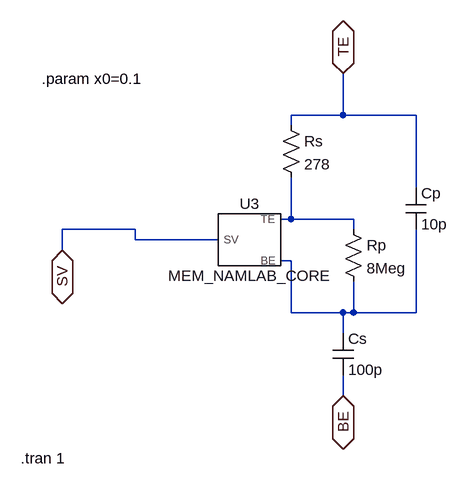
[diagram p0: schematic pseudo_memcapacitor.asc]
pseudo_memcapacitor.asc, the LTspice schematic file:
Version 4
SHEET 1 880 680
WIRE 64 -80 64 -144
WIRE 64 -80 -16 -80
WIRE 176 -80 64 -80
WIRE -16 -64 -16 -80
WIRE 176 32 176 -80
WIRE -16 80 -16 16
WIRE -16 80 -32 80
WIRE 80 80 -16 80
WIRE -256 96 -368 96
WIRE 80 96 80 80
WIRE -256 112 -256 96
WIRE -128 112 -256 112
WIRE -368 128 -368 96
WIRE -16 144 -32 144
WIRE -16 224 -16 144
WIRE 64 224 -16 224
WIRE 80 224 80 176
WIRE 80 224 64 224
WIRE 176 224 176 96
WIRE 176 224 80 224
WIRE 64 256 64 224
WIRE 64 352 64 320
FLAG -368 128 SV
IOPIN -368 128 BiDir
FLAG 64 -144 TE
IOPIN 64 -144 BiDir
FLAG 64 352 BE
IOPIN 64 352 BiDir
SYMBOL cap 160 32 R0
SYMATTR InstName Cp
SYMATTR Value 10p
SYMBOL cap 48 256 R0
SYMATTR InstName Cs
SYMATTR Value 100p
SYMBOL res 64 80 R0
SYMATTR InstName Rp
SYMATTR Value 8Meg
SYMBOL res -32 -80 R0
SYMATTR InstName Rs
SYMATTR Value 278
SYMBOL MEM_NAMLAB_CORE -80 112 R0
SYMATTR InstName U3
TEXT -432 448 Left 2 !.tran 1
TEXT -400 -136 Left 2 !.param x0=0.1

The netlist it stands for:
* pseudo_memcapacitor.asc
Cp TE N002 10p
Cs N002 BE 100p
Rp N001 N002 8Meg
Rs TE N001 278
XU3 N001 N002 SV MEM_NAMLAB_CORE  ; pins TE BE SV
.tran 1
.param x0=0.1
.lib C:\Users\dhanu\OneDrive\Documents\My files\GITHUB\Neuro-transistor-Simulation-with-Memristor-based-Memcapacitor-using-LTSPICE\src\Task 9 test\MEM_NAMLAB_CORE.cir
.backanno
.end